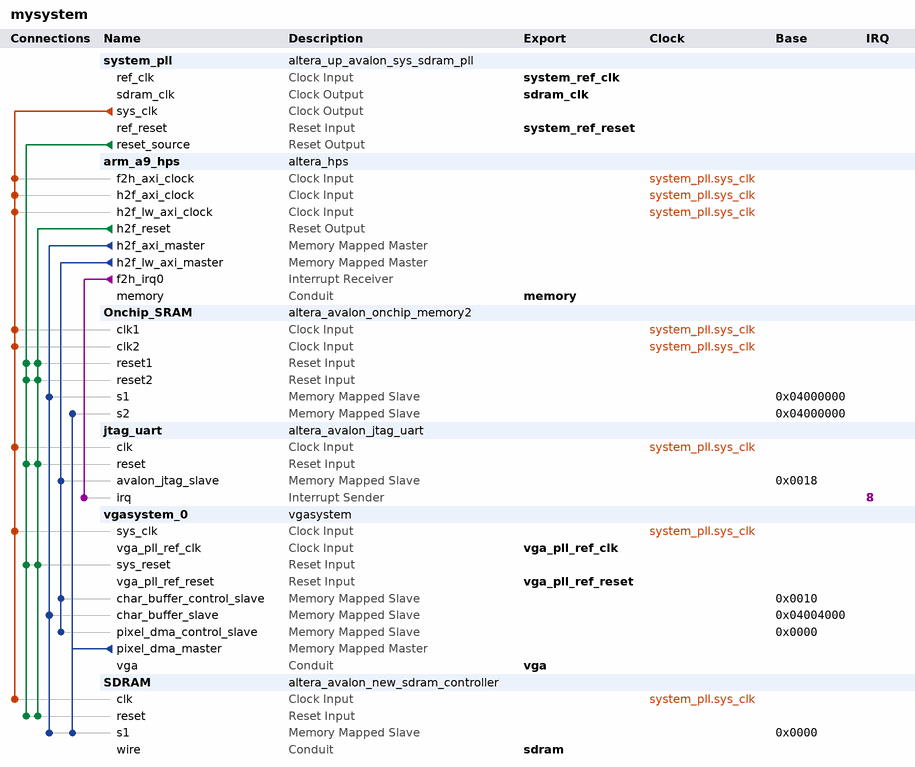
[diagram p0: system contents]
# Platform Designer (Qsys) system mysystem, Cyclone V 5CSEMA5F31C6
# Parameters at their usual value, and those the tool derives, are not listed.
package require -exact qsys 13.1
create_system mysystem
set_project_property DEVICE_FAMILY {Cyclone V}
set_project_property DEVICE 5CSEMA5F31C6

add_instance system_pll altera_up_avalon_sys_sdram_pll 13.1
set_instance_parameter_value system_pll gui_refclk 50.0
set_instance_parameter_value system_pll gui_outclk 50.0
set_instance_parameter_value system_pll CV_boards DE1-SoC

add_instance arm_a9_hps altera_hps 13.1
set_instance_parameter_value arm_a9_hps MEM_VENDOR JEDEC
set_instance_parameter_value arm_a9_hps MEM_CLK_FREQ_MAX 400.0
set_instance_parameter_value arm_a9_hps MEM_ROW_ADDR_WIDTH 12
set_instance_parameter_value arm_a9_hps MEM_COL_ADDR_WIDTH 8
set_instance_parameter_value arm_a9_hps MEM_DQ_WIDTH 8
set_instance_parameter_value arm_a9_hps MEM_BANKADDR_WIDTH 3
set_instance_parameter_value arm_a9_hps MEM_DRV_STR RZQ/6
set_instance_parameter_value arm_a9_hps MEM_RTT_NOM RZQ/6
set_instance_parameter_value arm_a9_hps MEM_RTT_WR {Dynamic ODT off}
set_instance_parameter_value arm_a9_hps MEM_WTCL 6
set_instance_parameter_value arm_a9_hps MEM_TCL 7
set_instance_parameter_value arm_a9_hps TIMING_TIS 175
set_instance_parameter_value arm_a9_hps TIMING_TIH 250
set_instance_parameter_value arm_a9_hps TIMING_TDS 50
set_instance_parameter_value arm_a9_hps TIMING_TDH 125
set_instance_parameter_value arm_a9_hps TIMING_TDQSQ 120
set_instance_parameter_value arm_a9_hps TIMING_TDQSCK 400
set_instance_parameter_value arm_a9_hps TIMING_TQSH 0.38
set_instance_parameter_value arm_a9_hps MEM_TINIT_US 499
set_instance_parameter_value arm_a9_hps MEM_TMRD_CK 3
set_instance_parameter_value arm_a9_hps MEM_TRAS_NS 40.0
set_instance_parameter_value arm_a9_hps MEM_TRCD_NS 15.0
set_instance_parameter_value arm_a9_hps MEM_TRP_NS 15.0
set_instance_parameter_value arm_a9_hps MEM_TREFI_US 7.0
set_instance_parameter_value arm_a9_hps MEM_TRFC_NS 75.0
set_instance_parameter_value arm_a9_hps MEM_TWTR 2
set_instance_parameter_value arm_a9_hps MEM_TFAW_NS 37.5
set_instance_parameter_value arm_a9_hps REF_CLK_FREQ 125.0
set_instance_parameter_value arm_a9_hps DEFAULT_FAST_SIM_MODEL true
set_instance_parameter_value arm_a9_hps TIMING_BOARD_MAX_CK_DELAY 0.6
set_instance_parameter_value arm_a9_hps TIMING_BOARD_MAX_DQS_DELAY 0.6
set_instance_parameter_value arm_a9_hps TIMING_BOARD_SKEW_CKDQS_DIMM_MIN -0.01
set_instance_parameter_value arm_a9_hps TIMING_BOARD_SKEW_CKDQS_DIMM_MAX 0.01
set_instance_parameter_value arm_a9_hps TIMING_BOARD_SKEW_WITHIN_DQS 0.02
set_instance_parameter_value arm_a9_hps TIMING_BOARD_SKEW_BETWEEN_DQS 0.02
set_instance_parameter_value arm_a9_hps TIMING_BOARD_DQ_TO_DQS_SKEW 0.0
set_instance_parameter_value arm_a9_hps TIMING_BOARD_AC_SKEW 0.02
set_instance_parameter_value arm_a9_hps TIMING_BOARD_AC_TO_CK_SKEW 0.0
set_instance_parameter_value arm_a9_hps MEM_CLK_FREQ 300.0
set_instance_parameter_value arm_a9_hps HPS_PROTOCOL DDR3
set_instance_parameter_value arm_a9_hps STM_Enable false
set_instance_parameter_value arm_a9_hps F2S_Width 2
set_instance_parameter_value arm_a9_hps S2F_Width 3
set_instance_parameter_value arm_a9_hps LWH2F_Enable true
set_instance_parameter_value arm_a9_hps F2SCLK_DBGRST_Enable false
set_instance_parameter_value arm_a9_hps F2SCLK_WARMRST_Enable false
set_instance_parameter_value arm_a9_hps F2SCLK_COLDRST_Enable false
set_instance_parameter_value arm_a9_hps F2SINTERRUPT_Enable true
set_instance_parameter_value arm_a9_hps EMAC1_PinMuxing Unused
set_instance_parameter_value arm_a9_hps EMAC1_Mode N/A
set_instance_parameter_value arm_a9_hps QSPI_PinMuxing Unused
set_instance_parameter_value arm_a9_hps QSPI_Mode N/A
set_instance_parameter_value arm_a9_hps SDIO_PinMuxing Unused
set_instance_parameter_value arm_a9_hps SDIO_Mode N/A
set_instance_parameter_value arm_a9_hps USB1_PinMuxing Unused
set_instance_parameter_value arm_a9_hps USB1_Mode N/A
set_instance_parameter_value arm_a9_hps SPIM1_PinMuxing Unused
set_instance_parameter_value arm_a9_hps SPIM1_Mode N/A
set_instance_parameter_value arm_a9_hps UART0_PinMuxing Unused
set_instance_parameter_value arm_a9_hps UART0_Mode N/A
set_instance_parameter_value arm_a9_hps I2C0_PinMuxing Unused
set_instance_parameter_value arm_a9_hps I2C0_Mode N/A
set_instance_parameter_value arm_a9_hps I2C1_PinMuxing Unused
set_instance_parameter_value arm_a9_hps I2C1_Mode N/A
set_instance_parameter_value arm_a9_hps S2FCLK_USER1CLK_FREQ 100
set_instance_parameter_value arm_a9_hps FPGA_PERIPHERAL_OUTPUT_CLOCK_FREQ_EMAC0_MD_CLK 100
set_instance_parameter_value arm_a9_hps FPGA_PERIPHERAL_OUTPUT_CLOCK_FREQ_EMAC0_GTX_CLK 100
set_instance_parameter_value arm_a9_hps FPGA_PERIPHERAL_OUTPUT_CLOCK_FREQ_EMAC1_MD_CLK 100
set_instance_parameter_value arm_a9_hps FPGA_PERIPHERAL_OUTPUT_CLOCK_FREQ_EMAC1_GTX_CLK 100

add_instance Onchip_SRAM altera_avalon_onchip_memory2 13.1
set_instance_parameter_value Onchip_SRAM dataWidth 32
set_instance_parameter_value Onchip_SRAM dualPort true
set_instance_parameter_value Onchip_SRAM initMemContent true
set_instance_parameter_value Onchip_SRAM initializationFileName onchip_mem.hex
set_instance_parameter_value Onchip_SRAM memorySize 16384

add_instance jtag_uart altera_avalon_jtag_uart 13.1
set_instance_parameter_value jtag_uart simInteractiveOptions NO_INTERACTIVE_WINDOWS

add_instance vgasystem_0 vgasystem 1.0

add_instance SDRAM altera_avalon_new_sdram_controller 13.1
set_instance_parameter_value SDRAM TAC 5.5
set_instance_parameter_value SDRAM TRCD 20.0
set_instance_parameter_value SDRAM TRP 20.0
set_instance_parameter_value SDRAM casLatency 3
set_instance_parameter_value SDRAM columnWidth 10
set_instance_parameter_value SDRAM dataWidth 16
set_instance_parameter_value SDRAM generateSimulationModel true
set_instance_parameter_value SDRAM model single_Micron_MT48LC4M32B2_7_chip
set_instance_parameter_value SDRAM numberOfBanks 4
set_instance_parameter_value SDRAM numberOfChipSelects 1
set_instance_parameter_value SDRAM powerUpDelay 100.0
set_instance_parameter_value SDRAM refreshPeriod 15.625
set_instance_parameter_value SDRAM rowWidth 13

# connections
add_connection system_pll.sys_clk arm_a9_hps.f2h_axi_clock clock
add_connection system_pll.sys_clk arm_a9_hps.h2f_axi_clock clock
add_connection system_pll.sys_clk arm_a9_hps.h2f_lw_axi_clock clock
add_connection system_pll.sys_clk jtag_uart.clk clock
add_connection system_pll.sys_clk Onchip_SRAM.clk1 clock
add_connection system_pll.sys_clk Onchip_SRAM.clk2 clock
add_connection system_pll.sys_clk SDRAM.clk clock
add_connection system_pll.sys_clk vgasystem_0.sys_clk clock
add_connection arm_a9_hps.h2f_reset jtag_uart.reset reset
add_connection arm_a9_hps.h2f_reset Onchip_SRAM.reset1 reset
add_connection arm_a9_hps.h2f_reset Onchip_SRAM.reset2 reset
add_connection arm_a9_hps.h2f_reset SDRAM.reset reset
add_connection arm_a9_hps.h2f_reset vgasystem_0.sys_reset reset
add_connection system_pll.reset_source jtag_uart.reset reset
add_connection system_pll.reset_source Onchip_SRAM.reset1 reset
add_connection system_pll.reset_source Onchip_SRAM.reset2 reset
add_connection system_pll.reset_source SDRAM.reset reset
add_connection system_pll.reset_source vgasystem_0.sys_reset reset
add_connection arm_a9_hps.h2f_axi_master Onchip_SRAM.s1 avalon
set_connection_parameter_value arm_a9_hps.h2f_axi_master/Onchip_SRAM.s1 baseAddress 0x04000000
add_connection arm_a9_hps.h2f_axi_master SDRAM.s1 avalon
set_connection_parameter_value arm_a9_hps.h2f_axi_master/SDRAM.s1 baseAddress 0x0000
add_connection arm_a9_hps.h2f_axi_master vgasystem_0.char_buffer_slave avalon
set_connection_parameter_value arm_a9_hps.h2f_axi_master/vgasystem_0.char_buffer_slave baseAddress 0x04004000
add_connection arm_a9_hps.h2f_lw_axi_master jtag_uart.avalon_jtag_slave avalon
set_connection_parameter_value arm_a9_hps.h2f_lw_axi_master/jtag_uart.avalon_jtag_slave baseAddress 0x0018
add_connection arm_a9_hps.h2f_lw_axi_master vgasystem_0.char_buffer_control_slave avalon
set_connection_parameter_value arm_a9_hps.h2f_lw_axi_master/vgasystem_0.char_buffer_control_slave baseAddress 0x0010
add_connection arm_a9_hps.h2f_lw_axi_master vgasystem_0.pixel_dma_control_slave avalon
set_connection_parameter_value arm_a9_hps.h2f_lw_axi_master/vgasystem_0.pixel_dma_control_slave baseAddress 0x0000
add_connection vgasystem_0.pixel_dma_master Onchip_SRAM.s2 avalon
set_connection_parameter_value vgasystem_0.pixel_dma_master/Onchip_SRAM.s2 baseAddress 0x04000000
add_connection vgasystem_0.pixel_dma_master SDRAM.s1 avalon
set_connection_parameter_value vgasystem_0.pixel_dma_master/SDRAM.s1 baseAddress 0x0000
add_connection arm_a9_hps.f2h_irq0 jtag_uart.irq interrupt
set_connection_parameter_value arm_a9_hps.f2h_irq0/jtag_uart.irq irqNumber 8

# exported interfaces
add_interface system_ref_clk clock sink
set_interface_property system_ref_clk EXPORT_OF system_pll.ref_clk
add_interface system_ref_reset reset sink
set_interface_property system_ref_reset EXPORT_OF system_pll.ref_reset
add_interface sdram_clk clock source
set_interface_property sdram_clk EXPORT_OF system_pll.sdram_clk
add_interface memory conduit end
set_interface_property memory EXPORT_OF arm_a9_hps.memory
add_interface vga_pll_ref_clk clock sink
set_interface_property vga_pll_ref_clk EXPORT_OF vgasystem_0.vga_pll_ref_clk
add_interface vga_pll_ref_reset reset sink
set_interface_property vga_pll_ref_reset EXPORT_OF vgasystem_0.vga_pll_ref_reset
add_interface vga conduit end
set_interface_property vga EXPORT_OF vgasystem_0.vga
add_interface sdram conduit end
set_interface_property sdram EXPORT_OF SDRAM.wire

set_interconnect_requirement {$system} qsys_mm.clockCrossingAdapter HANDSHAKE
set_interconnect_requirement {$system} qsys_mm.maxAdditionalLatency 1
set_interconnect_requirement {$system} qsys_mm.insertDefaultSlave false

save_system mysystem.qsys
